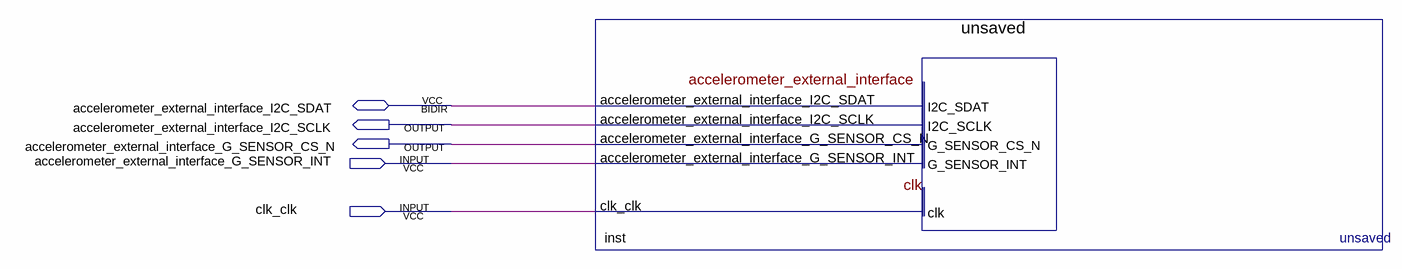
[diagram p0: schematic sheet]
// Quartus schematic Acelerometro.bdf as structural Verilog: 1 symbols, 5 pins
module Acelerometro (
  input  accelerometer_external_interface_G_SENSOR_INT,
  input  clk_clk,
  inout  accelerometer_external_interface_I2C_SDAT,
  output accelerometer_external_interface_I2C_SCLK,
  output accelerometer_external_interface_G_SENSOR_CS_N
);

  unsaved inst (
    .accelerometer_external_interface_G_SENSOR_INT(accelerometer_external_interface_G_SENSOR_INT),
    .clk_clk(clk_clk), .accelerometer_external_interface_I2C_SCLK(accelerometer_external_interface_I2C_SCLK),
    .accelerometer_external_interface_G_SENSOR_CS_N(accelerometer_external_interface_G_SENSOR_CS_N),
    .accelerometer_external_interface_I2C_SDAT(accelerometer_external_interface_I2C_SDAT));
endmodule
